# Altium schematic sheet BLE.SchDoc: RF/Bluetooth
size B; Author: Sébastien Gélinas; Organization: SmartHalo; Address1: 5445 de Gaspé; Address2: Montréal, QC; Address3: Canada; Address4: H2T 3B2; DocumentNumber: 4; Revision: 1; SheetNumber: 4; SheetTotal: 4
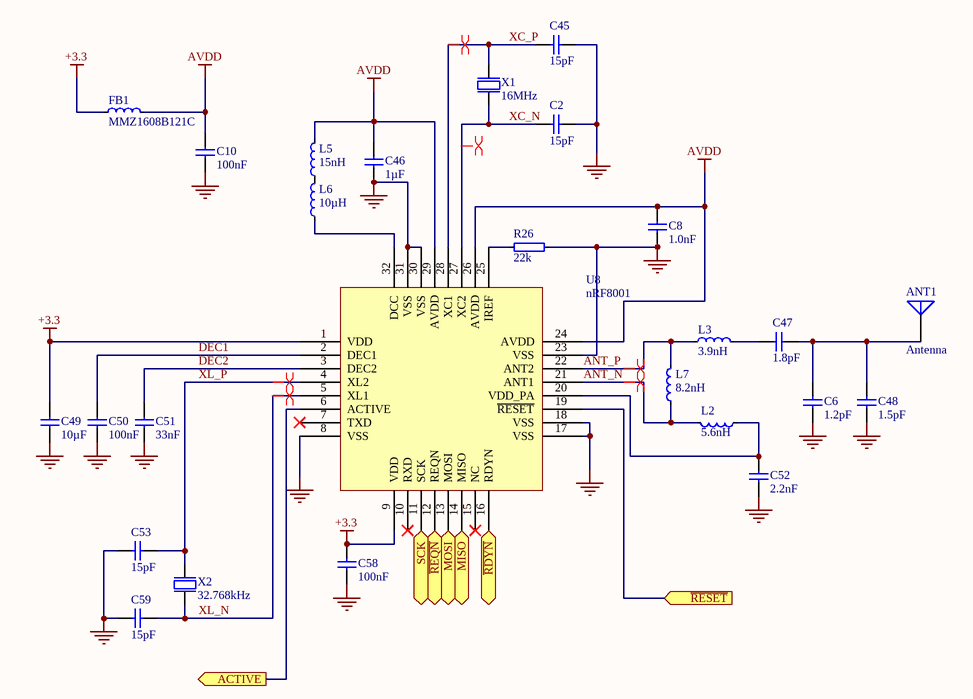
[diagram p0: BLE.SchDoc]

## Parts
ANT1  Antenna  [ANTENNA_PCB_2.4GHZ]  (no BOM)
C2  15pF  [CAPC0805(2012)100_N]
C6  1.2pF  [0402s]
C8  1.0nF  [CAPC0603(1608)100_N]
C10  100nF  [CAPC0805(2012)100_N]
C45  15pF  [CAPC0805(2012)100_N]
C46  1µF  [CAPC0805(2012)100_N]
C47  1.8pF  [0402s]
C48  1.5pF  [0402s]
C49  10µF  [CAPC0805(2012)100_N]
C50  100nF  [CAPC0805(2012)100_N]
C51  33nF  [CAPC0805(2012)100_N]
C52  2.2nF  [0402s]
C53  15pF  [CAPC0805(2012)100_N]
C58  100nF  [CAPC0805(2012)100_N]
C59  15pF  [CAPC0805(2012)100_N]
FB1  MMZ1608B121C  [CAPC0805(2012)100_N]
L2  5.6nH  [0402s]
L3  3.9nH  [0402s]
L5  15nH  [CAPC0603(1608)100_N]
L6  10µH  [CAPC0603(1608)100_N]
L7  8.2nH  [0402s]
R26  22k  [RESC0805(2012)_N]
U8  nRF8001  [Nordic_QFN50P500X500X90-33N]
X1  16MHz  [CRYSTAL_16MHz_SMT4]
X2  32.768kHz  [CRYSTAL_32.768kHz_SMT2]

## Ports
ACTIVE (out), MISO (out), MOSI (in), SCK (in), ~{RDYN} (out), ~{REQN} (in), ~{RESET} (in)

## Nets
+3.3: C49.2 C58.2 FB1.1 U8.1(VDD) U8.9(VDD)
AVDD: C8.1 C10.2 C46.2 FB1.2 L5.2 U8.24(AVDD) U8.26(AVDD) U8.29(AVDD)
GND: C2.1 C6.2 C8.2 C10.1 C45.1 C46.1 C48.2 C49.1 C50.1 C51.1 C52.1 C53.1 C58.1 C59.1 R26.2 U8.8(VSS) U8.17(VSS) U8.18(VSS) U8.23(VSS) U8.30(VSS) U8.31(VSS) U8.33(GND) X1.2(GND) X1.4(GND)
ACTIVE: U8.6(ACTIVE) ; port ACTIVE
ANT_N: L2.2 L7.1 U8.21(ANT1)
ANT_P: L3.1 L7.2 U8.22(ANT2)
DEC1: C50.2 U8.2(DEC1)
DEC2: C51.2 U8.3(DEC2)
MISO: U8.14(MISO) ; port MISO
MOSI: U8.13(MOSI) ; port MOSI
~{RDYN}: U8.16(RDYN) ; port ~{RDYN}
~{REQN}: U8.12(REQN) ; port ~{REQN}
~{RESET}: U8.19(~{RESET}) ; port ~{RESET}
SCK: U8.11(SCK) ; port SCK
XC_N: C2.2 U8.27(XC2) X1.3(out)
XC_P: C45.2 U8.28(XC1) X1.1(inp)
XL_N: C59.2 U8.5(XL1) X2.2(out)
XL_P: C53.2 U8.4(XL2) X2.1(inp)
NetANT1_1: ANT1.1 C6.1 C47.1 C48.1
NetC47_2: C47.2 L3.2
NetC52_2: C52.2 L2.1 U8.20(VDD_PA)
NetL5_1: L5.1 L6.2
NetL6_1: L6.1 U8.32(DCC)
NetR26_1: R26.1 U8.25(IREF)

Not connected (* = marked no-connect by the designer): U8 7(TXD)* 10(RXD)* 15(NC)*

## Layout directives
differential pair: ANT_N, ANT_P, XC_N, XC_P, XL_N, XL_P

## Notes on the sheet
- Title
- Size:
- Date:
- B
- Author:
- Time:
- Sheet
- Revision:
- of
- File:

## Library data of the parts
ANT1 = ANTENNA_PCB_2.4GHz: Antenna PCB, 2.4GHz, 26.11 mm x 1.27 mm, FR4 60 mils, Er = 4.2
C2 C45 C53 C59 = C0402-15p: CAP 15pF *V ±5% NP0 0805 (2012 Metric); Case-EIA: 0805; Case-Metric: 2012; Capacitance: 15pF; Tolerance: ±5%; Rated Voltage: *; Dielectric: NP0
C6 = C0402-1.2p: CAP 1.2pF *V ±5% NP0 0402 (1005 Metric); Case-EIA: 0402; Case-Metric: 1005; Capacitance: 1.2pF; Dielectric: NP0; Tolerance: ±5%; Rated Voltage: *
C8 = C0402-1n0: CAP 1.0nF *V ±10% X7R 0603 (1608 Metric); Case-EIA: 0603; Case-Metric: 1608; Capacitance: 1.0nF; Rated Voltage: *; Tolerance: ±10%; Dielectric: X7R
C10 = C0402-100n: CAP 100nF *V ±10% X7R 0805 (2012 Metric); Case-EIA: 0805; Case-Metric: 2012; Capacitance: 100nF; Rated Voltage: *; Tolerance: ±10%; Dielectric: X7R
C46 = C0603-1µ0: CAP 1.0uF 10V ±10% X7R 0805 (2012 Metric); Manufacturer: TAIYO YUDEN; Manufacturer Part Number: LMK107B7105KA-T; Case-EIA: 0805; Case-Metric: 2012; Capacitance: 1µF; Rated Voltage: 10V; Tolerance: ±10%; Dielectric: X7R
C47 = C0402-1.8p: CAP 1.8pF *V ±0.1pF NP0 0402 (1005 Metric); Manufacturer: JOHANSON TECHNOLOGY; Manufacturer Part Number: 500R07S1R8BV4T; Case-EIA: 0402; Case-Metric: 1005; Capacitance: 1.8pF; Dielectric: NP0; Tolerance: ±0.1pF; Rated Voltage: *
C48 = C0402-1.2p: CAP 1.5pF *V ±5% NP0 0402 (1005 Metric); Case-EIA: 0402; Case-Metric: 1005; Capacitance: 1.5pF; Tolerance: ±5%; Dielectric: NP0; Rated Voltage: *
C49 = C0603-1µ0: CAP 10uF 10V ±10% X7R 0805 (2012 Metric); Manufacturer: TAIYO YUDEN; Manufacturer Part Number: LMK107B7105KA-T; Case-EIA: 0805; Case-Metric: 2012; Capacitance: 10µF; Dielectric: X7R; Rated Voltage: 10V; Tolerance: ±10%
C50 = C0402-100n: CAP 100nF 10V ±10% X7R 0805 (2012 Metric); Case-EIA: 0805; Case-Metric: 2012; Capacitance: 100nF; Tolerance: ±10%; Dielectric: X7R; Rated Voltage: 10V
C51 = C0402-33n: CAP 33nF 10V ±10% X7R 0805 (2012 Metric); Note: Chip Cap 10%; Case-EIA: 0805; Case-Metric: 2012; Capacitance: 33nF; Tolerance: ±10%; Dielectric: X7R; Rated Voltage: 10V
C52 = C0402-2n2: CAP 2.2nF *V ±10% X7R 0402 (1005 Metric); Case-EIA: 0402; Case-Metric: 1005; Capacitance: 2.2nF; Dielectric: X7R; Tolerance: ±10%; Rated Voltage: *
C58 = C0402-100n: CAP 100nF *V ±10% X7R 0805 (2012 Metric); Note: Chip Cap 10%; Case-EIA: 0805; Case-Metric: 2012; Capacitance: 100nF; Tolerance: ±10%; Rated Voltage: *; Dielectric: X7R
FB1 = L0402-15n: Ferrite bead 0805; Case-EIA: 0805; Case-Metric: 2012
L2 = L0402-5n6: IND 5.6nH 0402 (1005 Metric); Manufacturer: Murata; Manufacturer Part Number: LQP15MN5N6B02D; Note: LQP15MN5N6B02D 5.6nH 140mA 0402; Case-EIA: 0402; Case-Metric: 1005; Value: 5.6nH
L3 = L0402-3n9: IND 3.9nH 0402 (1005 Metric); Manufacturer: Murata; Manufacturer Part Number: LQP15MN3N9B02D; Note: LQP15MN3N9B02D 3.9nH 170mA 0402; Case-EIA: 0402; Case-Metric: 1005; Inductance: 3.9nH
L5 = L0402-15n: IND 15nH 0603 (1608 Metric); Case-EIA: 0603; Case-Metric: 1608; Inductance: 15nH
L6 = L0603-10µ: IND 10uH 0603 (1608 Metric); Manufacturer: Taiyo Yuden; Manufacturer Part Number: LBMF1608T100K; Case-EIA: 0603; Case-Metric: 1608; Inductance: 10µH
L7 = L0402-8n2: IND 8.2nH 0402 (1005 Metric); Manufacturer Part Number: LQP15MN8N2B02D; Note: LQP15MN8N2B02D 8.2nH 110mA 0402; Case-EIA: 0402; Case-Metric: 1005; Inductance: 8.2nH
R26 = R0402-22k: 22K *W 1% 0805 (2012 Metric); Note: Chip Res 1%; Case-EIA: 0805; Case-Metric: 2012; Resistance: 22k; Tolerance: ±1%; Power: *
U8 = nRF8001: IC BLUETOOTH TRANSCEIVER 32QFN
X1 = XTAL_TSX-3225: XTAL SMD 16MHz, 9pF, Mercury; Part Number: XTAL SMD 16MHz (3225); Note: XTAL SMD 16MHz 3225; Artikkelnr Noca: 22019087; Value: 16MHz; Manufacturer: *; Manufacturer Part Number: *; Datasheet: http://ndap3-net.ebz.epson.co.jp/w/www/PDFS/epdoc_qd.nsf/85a4e2c523a1f89349257068002f9e30/31e98956c8f991cd4925707c003b38b1/$FILE/FA-238_238V_TSX-3225_E08X.pdf; Footprint: BT-XTAL_3225; LatestRevisionDate: 2010-02-24; Pin Count: 4; Publisher: Nordic Semiconductor; Published: 2009-05-30; Supplier: *; Supplier part number: *; 2nd source Supplier: *; 2nd source part number: *
X2 = XTAL_FC-135 32.768k: EPSON TOYOCOM - FC-135 32.768KHZ ±20PPM,9.0PF - CRYSTAL, SM, WATCH; Note: XTAL SMD 32.768kHz, 3215; Artikkelnr Noca: 2.20191e+007; Part Number: XTAL_FC-135 32.768k; Manufacturer: Epson Toyocom; Manufacturer Part Number: FC-135 32.768KHZ ±20PPM,9.0PF; Datasheet: http://www.farnell.com/datasheets/57480.pdf; Footprint: FC-135; LatestRevisionDate: 2010-10-18; Pin Count: 2; Publisher: Nordic Semiconductor; Published: 2010-10-18; Value: 32.768kHz; Supplier: Farnell; Supplier part number: 127-8037; 2nd source Supplier: *; 2nd source part number: *